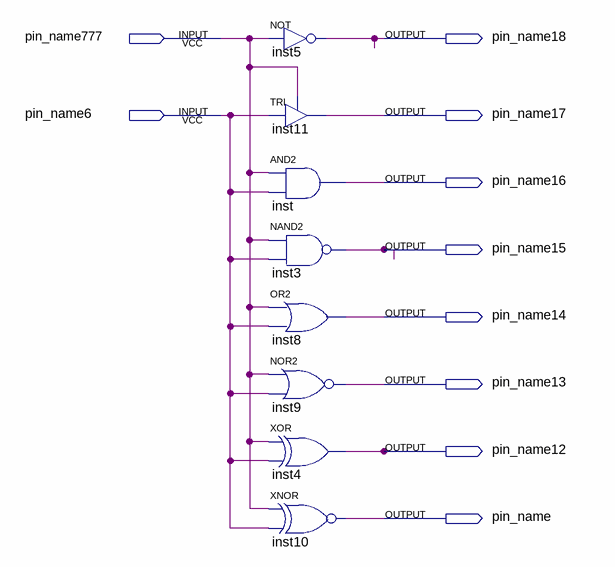
[diagram p0: schematic sheet]
// Quartus schematic 913028.bdf as structural Verilog: 8 symbols, 10 pins
module \913028  (
  input  pin_name777,
  input  pin_name6,
  output pin_name18,
  output pin_name17,
  output pin_name16,
  output pin_name15,
  output pin_name14,
  output pin_name13,
  output pin_name12,
  output pin_name
);

  not inst5 (pin_name18, pin_name777);
  TRI inst11 (.IN(pin_name6), .OE(pin_name777), .OUT(pin_name17));
  and inst (pin_name16, pin_name777, pin_name6);
  nand inst3 (pin_name15, pin_name777, pin_name6);
  or inst8 (pin_name14, pin_name777, pin_name6);
  nor inst9 (pin_name13, pin_name777, pin_name6);
  xor inst4 (pin_name12, pin_name777, pin_name6);
  xnor inst10 (pin_name, pin_name777, pin_name6);
endmodule
